# EAGLE design Double Socket_ESP-12 (EAGLE 8.3.2)
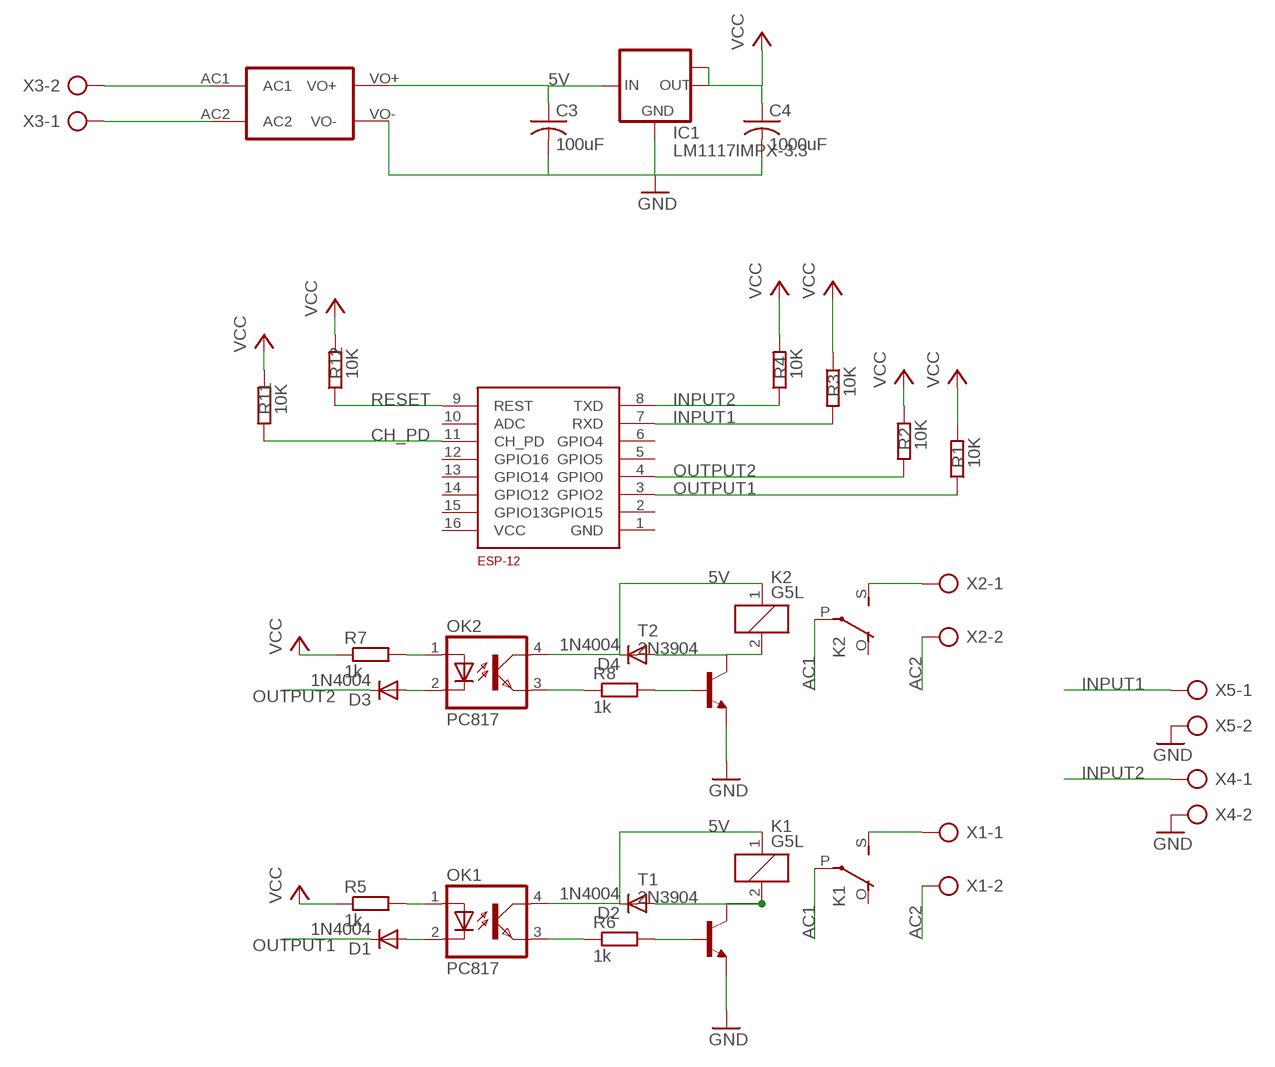
[diagram p0: schematic, sheet 1]

## Parts
C3  100uF  C-USC0805  [C0805]
C4  1000uF  C-USC0805  [C0805]
D1  1N4004  [DO41-10]
D2  1N4004  [DO41-10]
D3  1N4004  [DO41-10]
D4  1N4004  [DO41-10]
ESP-12  ESP8266_ESP-12  [ESP8266-ESP12]
IC1  LM1117IMPX-3.3  [SOT223]
K1  G5L  [G5LE]
K2  G5L  [G5LE]
OK1  PC817  [DIL04]
OK2  PC817  [DIL04]
R1  10K  R-EU_M0805  [M0805]
R2  10K  R-EU_M0805  [M0805]
R3  10K  R-EU_M0805  [M0805]
R4  10K  R-EU_M0805  [M0805]
R5  1k  R-EU_M0805  [M0805]
R6  1k  R-EU_M0805  [M0805]
R7  1k  R-EU_M0805  [M0805]
R8  1k  R-EU_M0805  [M0805]
R11  10K  R-EU_M0805  [M0805]
R12  10K  R-EU_M0805  [M0805]
T1  2N3904  [TO92]
T2  2N3904  [TO92]
U$1  HLK-PM01  [HLK-PM01]
X1  AK500/2-H  [AK500/2-H]
X2  AK500/2-H  [AK500/2-H]
X3  AK500/2-H  [AK500/2-H]
X4  AK500/2-H  [AK500/2-H]
X5  AK500/2-H  [AK500/2-H]

## Nets
5V: C3.1 D2.C D4.C IC1.3(IN) K1.1 K2.1 OK1.4(COL) OK2.4(COL) U$1.VO+
AC1: K1.P(2:P) K2.P(2:P) U$1.AC1 X3.2
AC2: U$1.AC2 X1.2 X2.2 X3.1
CH_PD: ESP-12.11(CH_PD) R11.1
GND: C3.2 C4.2 IC1.1(GND) T1.3(E) T2.3(E) U$1.VO- X4.2 X5.2
INPUT1: ESP-12.7(RXD) R3.2 X5.1
INPUT2: ESP-12.8(TXD) R4.1 X4.1
N$2: K1.S(2:S) X1.1
N$7: R6.2 T1.2(B)
N$8: D2.A K1.2 T1.1(C)
N$12: R8.2 T2.2(B)
N$13: D4.A K2.2 T2.1(C)
N$14: K2.S(2:S) X2.1
OPT_EMITTER2: OK1.3(EMIT) R6.1
OPT_LED-2: D1.A OK1.2(C)
OPTO_EMITTER1: OK2.3(EMIT) R8.1
OPTO_LED+1: OK2.1(A) R7.2
OPTO_LED+2: OK1.1(A) R5.2
OPTO_LED-1: D3.A OK2.2(C)
OUTPUT1: D1.C ESP-12.3(GPIO2) R1.1
OUTPUT2: D3.C ESP-12.4(GPIO0) R2.1
RESET: ESP-12.9(REST) R12.1
VCC: C4.1 IC1.2(OUT) IC1.TAB(OUT1) R1.2 R2.2 R3.1 R4.2 R5.1 R7.1 R11.2 R12.2
Unconnected: ESP-12.1(GND) ESP-12.2(GPIO15) ESP-12.5(GPIO5) ESP-12.6(GPIO4) ESP-12.10(ADC) ESP-12.12(GPIO16) ESP-12.13(GPIO14) ESP-12.14(GPIO12) ESP-12.15(GPIO13) ESP-12.16(VCC) K1.O(2:O) K2.O(2:O)

## Library data of the parts
C3 C4 = rcl:C-US: CAPACITOR, American symbol
D1-D4 = diode:1N4004: DIODE general purpose rectifier, 1 A
ESP-12 = ESP8266-ESP12:ESP8266_ESP-12
IC1 = lm1117:LM1117IMPX-*
K1 K2 = relay:G5L: RELAY 1 x switch, 10 A/120 V AC, 8 A/30 V ADC, Omron; OC_FARNELL: unknown; OC_NEWARK: unknown
OK1 OK2 = optocoupler:PC817: SHARP OPTO COUPLER; MPN: PC817X4J000F; OC_FARNELL: 9707727; OC_NEWARK: 97K7059
R1-R8 R11 R12 = rcl:R-EU_: RESISTOR, European symbol
T1 T2 = transistor:2N3904: NPN TRANSISTOR
U$1 = aobotelhoLibrary:HLK-PM01
X1-X5 = con-ptr500:AK500/2-H: CONNECTOR Aug. 2004 / PTR Meßtechnik: Die Bezeichnung der Serie AK505 wurde geändert. Es handelt sich hierbei um AK500 in horizontaler Ausführung.

## Board
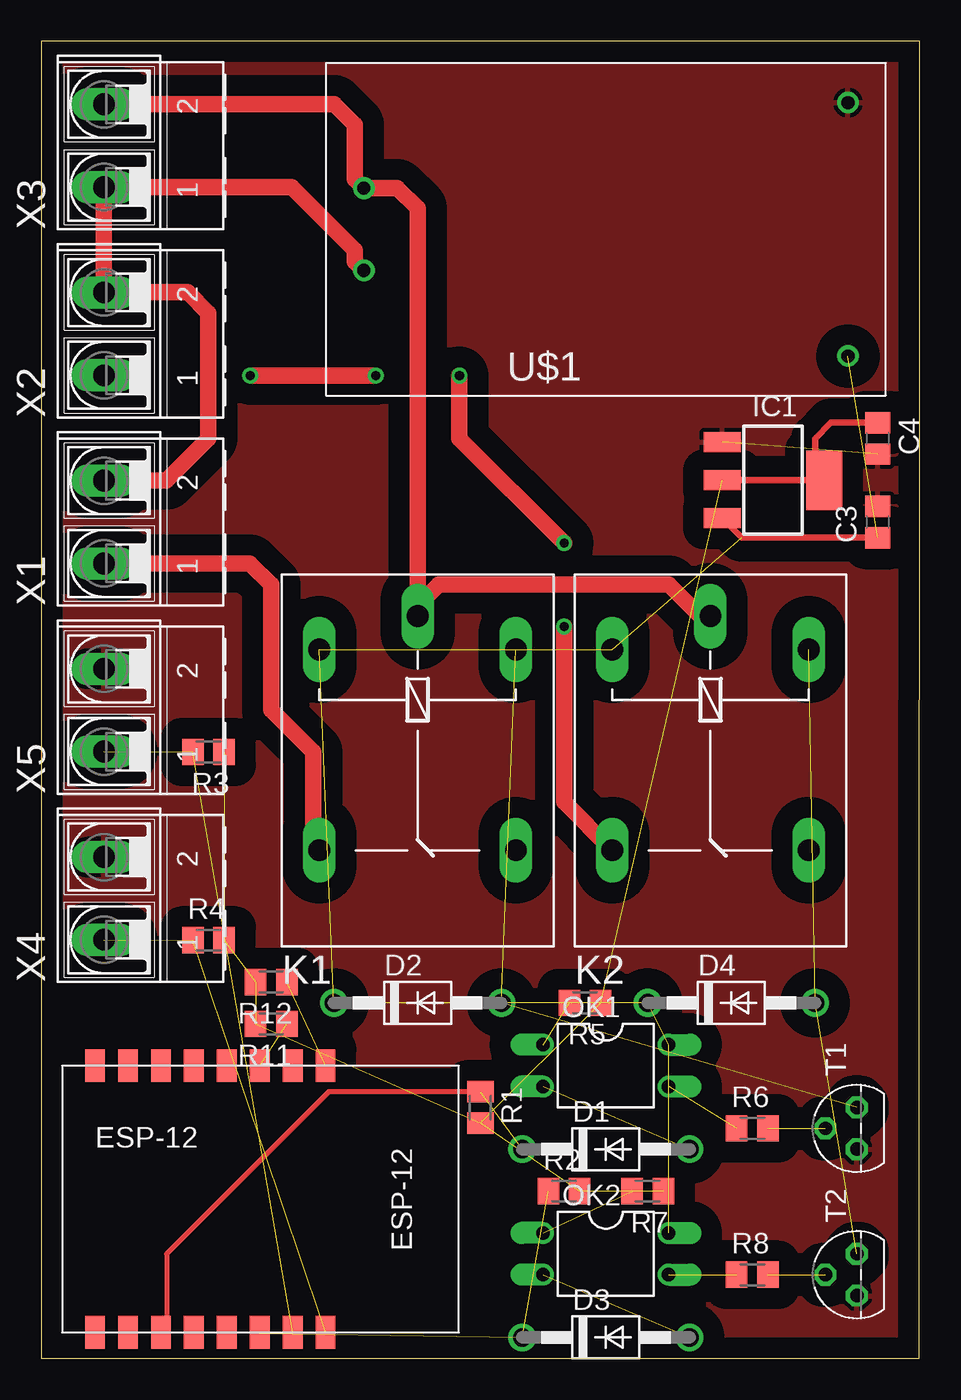
[diagram p1: board, top side]
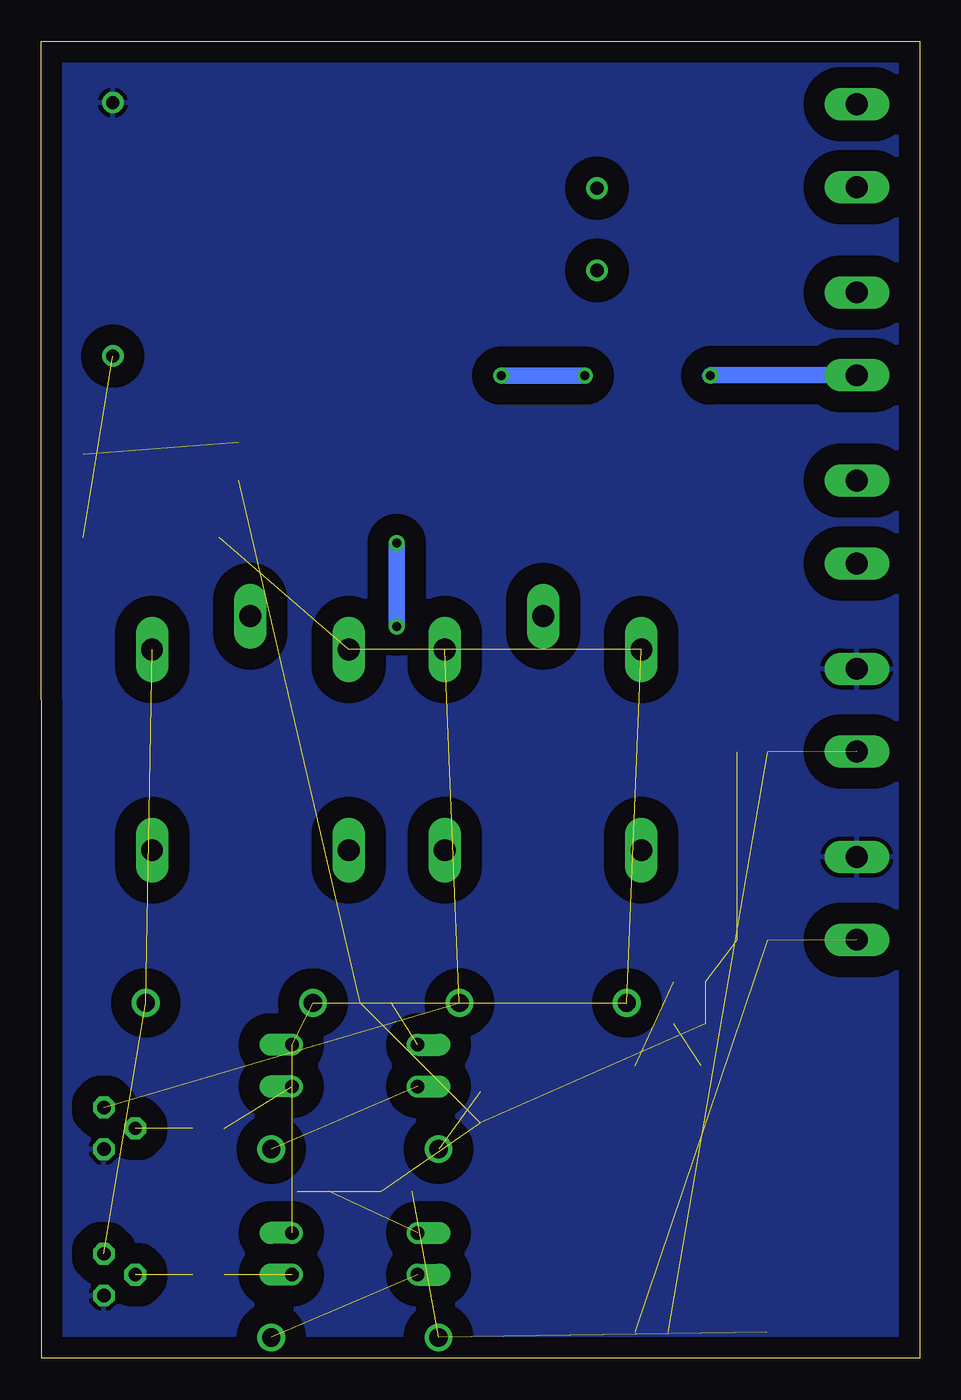
[diagram p2: board, bottom side, seen from below]

Size 53.34 x 80.01 mm. Coordinates in mm from the lower left corner, seen from the top.
Outline: 0,0 53.32,0 53.34,80.01 0,80.01 0,0
Copper layers (1*16): Top 0.035mm / dielectric 1.5mm / Bottom 0.035mm
Design rules "default": minimum track width 6mil, minimum drill 0.35mm, track to track 6mil, track to pad 6mil, pad to pad 6mil, via to via 6mil, smd to smd 6mil, copper to edge 40mil, drill to drill 6mil, minimum pad ring 10mil, minimum via ring 8mil, stop-mask expansion 4mil, vias tented up to drill 0mil, thermal gap 10mil

### Footprints (pad centres in the part's own frame; a part is rotated, then mirrored left to right if it is on the bottom)
C0805 = smd 1.3 x 1.5: 1 -0.95,0; 2 0.95,0
DO41-10 = drill 1.118: A 5.08,0; C -5.08,0
ESP8266-ESP12 = smd 2 x 1.2: 1 8.58,-9.43; 2 8.58,-7.43; 3 8.58,-5.43; 4 8.58,-3.43; 5 8.58,-1.43; 6 8.58,0.57; 7 8.58,2.57; 8 8.58,4.57; 9 -7.62,4.57; 10 -7.62,2.57; 11 -7.62,0.57; 12 -7.62,-1.43; 13 -7.62,-3.43; 14 -7.62,-5.43; 15 -7.62,-7.43; 16 -7.62,-9.43
SOT223 = smd 1.219 x 2.235: 1 -2.311,-3.099; 2 0,-3.099; 3 2.311,-3.099 | smd 3.6 x 2.2: TAB 0,3.099
G5LE = drill 1.321 long: 1 -7.493,-5.969; 2 -7.493,5.969; O 4.699,5.969; P -9.525,0; S 4.699,-5.969
DIL04 = drill 0.813 offset: 1 -1.27,-3.81; 2 1.27,-3.81; 3 1.27,3.81; 4 -1.27,3.81
M0805 = smd 1.3 x 1.6: 1 -0.95,0; 2 0.95,0
TO92 = drill 0.813 octagon: 1 1.27,0; 2 0,1.905; 3 -1.27,0
HLK-PM01 = drill 0.8: AC1 -14.7,2.5; AC2 -14.7,-2.5; VO+ 14.7,-7.7; VO- 14.7,7.7
AK500/2-H = drill 1.321 long: 1 -2.515,0; 2 2.515,0

### Placement (x,y rotation side)
C3  50.8,50.8 90 top
C4  50.8,55.88 270 top
D1  34.29,12.7 0 top
D2  22.86,21.59 0 top
D3  34.29,1.27 0 top
D4  41.91,21.59 0 top
ESP-12  12.7,10.16 270 top
IC1  44.45,53.34 270 top
K1  22.86,35.56 270 top
K2  40.64,35.56 270 top
OK1  34.29,17.78 270 top
OK2  34.29,6.35 270 top
R1  26.67,15.24 270 top
R2  31.75,10.16 0 top
R3  10.16,36.83 180 top
R4  10.16,25.4 0 top
R5  33.02,21.59 180 top
R6  43.18,13.97 0 top
R7  36.83,10.16 180 top
R8  43.18,5.08 0 top
R11  13.97,20.32 180 top
R12  13.97,22.86 180 top
T1  49.53,13.97 90 top
T2  49.53,5.08 90 top
U$1  34.29,68.58 0 top
X1  3.81,50.8 90 top
X2  3.81,62.23 90 top
X3  3.81,73.66 90 top
X4  3.81,27.94 90 top
X5  3.81,39.37 90 top

### Tracks (layer width: path | path; a pad name or v marks a point on that pad's centre or on a via)
5V  (7 unrouted)
  Top 0.406: C3.1 42.53,49.85 IC1.3
AC1
  Top 1.016: X3.2 17.8,76.17 19.05,74.93 19.05,71.62 U$1.AC1 21.63,71.08 22.86,69.85 22.86,45.72 | 22.86,45.72 K1.P | K2.P 40.01,45.09 38.1,46.99 24.13,46.99 22.86,45.72
AC2
  Top 1.016: U$1.AC2 19.05,66.62 19.05,67.31 15.21,71.14 X3.1 X2.2 3.83,64.77 8.89,64.77 10.16,63.5 10.16,55.88 7.59,53.31 X1.2
CH_PD  (1 unrouted)
GND  (1 unrouted)
  pour Bottom (isolate 1.27): 0,0 53.34,0 53.34,80.01 0,80.01
  pour Top (isolate 1.27): 0,0 53.34,0 53.34,80.01 0,80.01
INPUT1  (2 unrouted)
INPUT2  (2 unrouted)
N$2
  Top 1.016: X1.1 12.68,48.28 13.97,46.99 13.97,39.37 16.51,36.83 16.51,31.24 K1.S
N$7  (1 unrouted)
N$8  (2 unrouted)
N$12  (1 unrouted)
N$13  (2 unrouted)
N$14  (via drill 0.55)
  Top 1.016: v20.32,59.69 v12.7,59.69 | v25.4,59.69 25.4,55.88 v31.75,49.53 | v31.75,44.45 31.75,33.78 K2.S
  Bottom 1.016: X2.1 12.68,59.72 v12.7,59.69 | v20.32,59.69 v25.4,59.69 | v31.75,49.53 v31.75,44.45
OPT_EMITTER2  (1 unrouted)
OPT_LED-2  (1 unrouted)
OPTO_EMITTER1  (1 unrouted)
OPTO_LED+1  (1 unrouted)
OPTO_LED+2  (1 unrouted)
OPTO_LED-1  (1 unrouted)
OUTPUT1  (1 unrouted)
  Top 0.305: R1.1 17.46,16.19 7.62,6.35 7.62,1.93 ESP-12.3
OUTPUT2  (2 unrouted)
RESET  (1 unrouted)
VCC  (8 unrouted)
  Top 0.406: C4.1 47.94,56.83 46.99,55.88 46.99,53.9 IC1.TAB IC1.2